# EAGLE design DummyLoad (EAGLE 5.10)
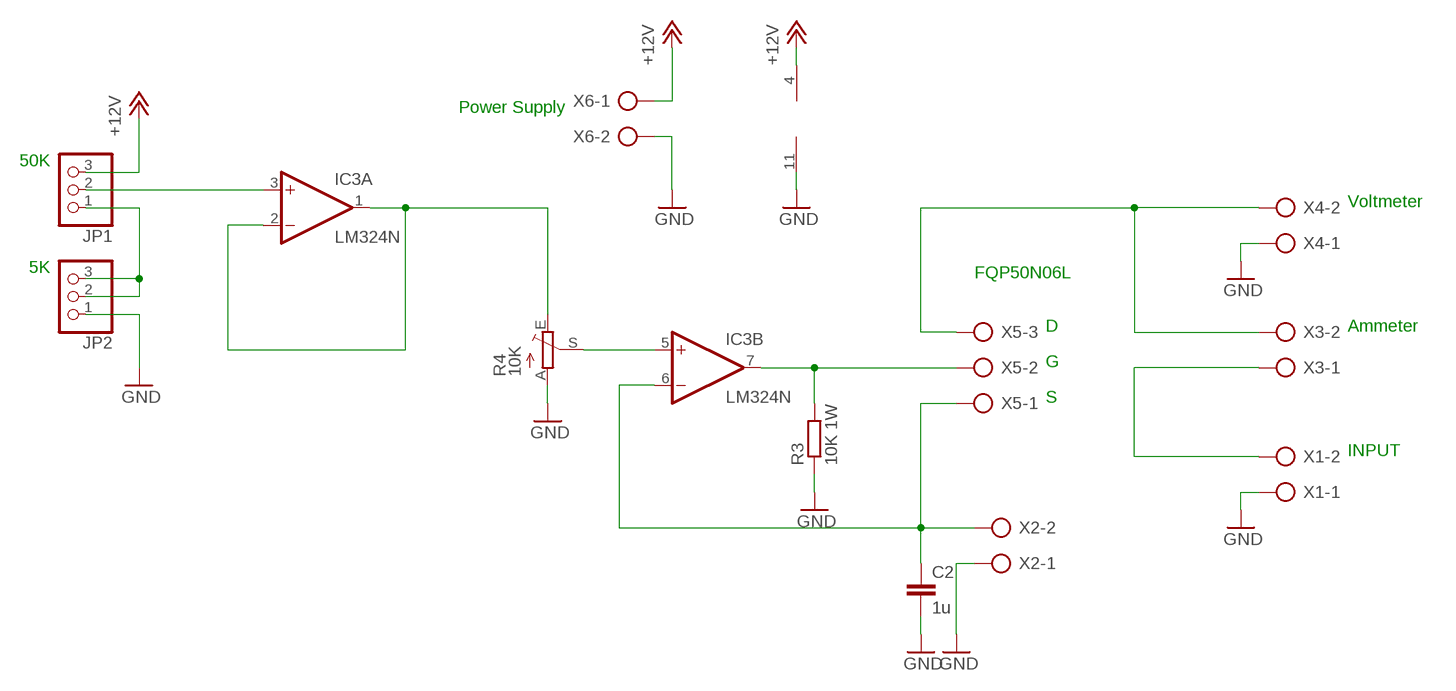
[diagram p0: schematic, sheet 1]

## Parts
C2  1u  C-EU102-043X133  [C102-043X133]
IC3  LM324N  [DIL14]
JP1  PINHD-1X3  [1X03]
JP2  PINHD-1X3  [1X03]
R3  10K 1W  R-EU_0309/12  [0309/12]
R4  10K  TRIM_EU-B64Y  [B64Y]
X1  AK300/2  [AK300/2]
X2  AK300/2  [AK300/2]
X3  AK300/2  [AK300/2]
X4  AK300/2  [AK300/2]
X5  AK300/3  [AK300/3]
X6  AK300/2  [AK300/2]

## Nets
+12V: IC3.4(P:V+) JP1.3 X6.1
GND: C2.2 IC3.11(P:V-) JP2.1 R3.1 R4.A X1.1 X2.1 X4.1 X6.2
N$1: IC3.1(A:OUT) IC3.2(A:-IN) R4.E
N$2: IC3.7(B:OUT) R3.2 X5.2
N$3: IC3.5(B:+IN) R4.S
N$4: X1.2 X3.1
N$5: IC3.3(A:+IN) JP1.2
N$7: C2.1 IC3.6(B:-IN) X2.2 X5.1
N$8: JP1.1 JP2.2 JP2.3
N$9: X3.2 X4.2 X5.3
Unconnected: IC3.8(C:OUT) IC3.9(C:-IN) IC3.10(C:+IN) IC3.12(D:+IN) IC3.13(D:-IN) IC3.14(D:OUT)

## Notes on the sheet
- Power Supply
- 50K
- Voltmeter
- 5K
- FQP50N06L
- D | Ammeter
- G
- S
- INPUT

## Library data of the parts
C2 = resistor:C-EU: CAPACITOR, European symbol
IC3 = linear:LM324: OP AMP
JP1 JP2 = pinhead:PINHD-1X3: PIN HEADER
R3 = resistor:R-EU_: RESISTOR, European symbol
R4 = pot:TRIM_EU-: POTENTIOMETER
X1-X4 X6 = con-ptr500:AK300/2: CONNECTOR
X5 = con-ptr500:AK300/3: CONNECTOR

## Net classes
0 default: width 0.508 mm, drill 0.762 mm, clearance 0.508 mm

## Board
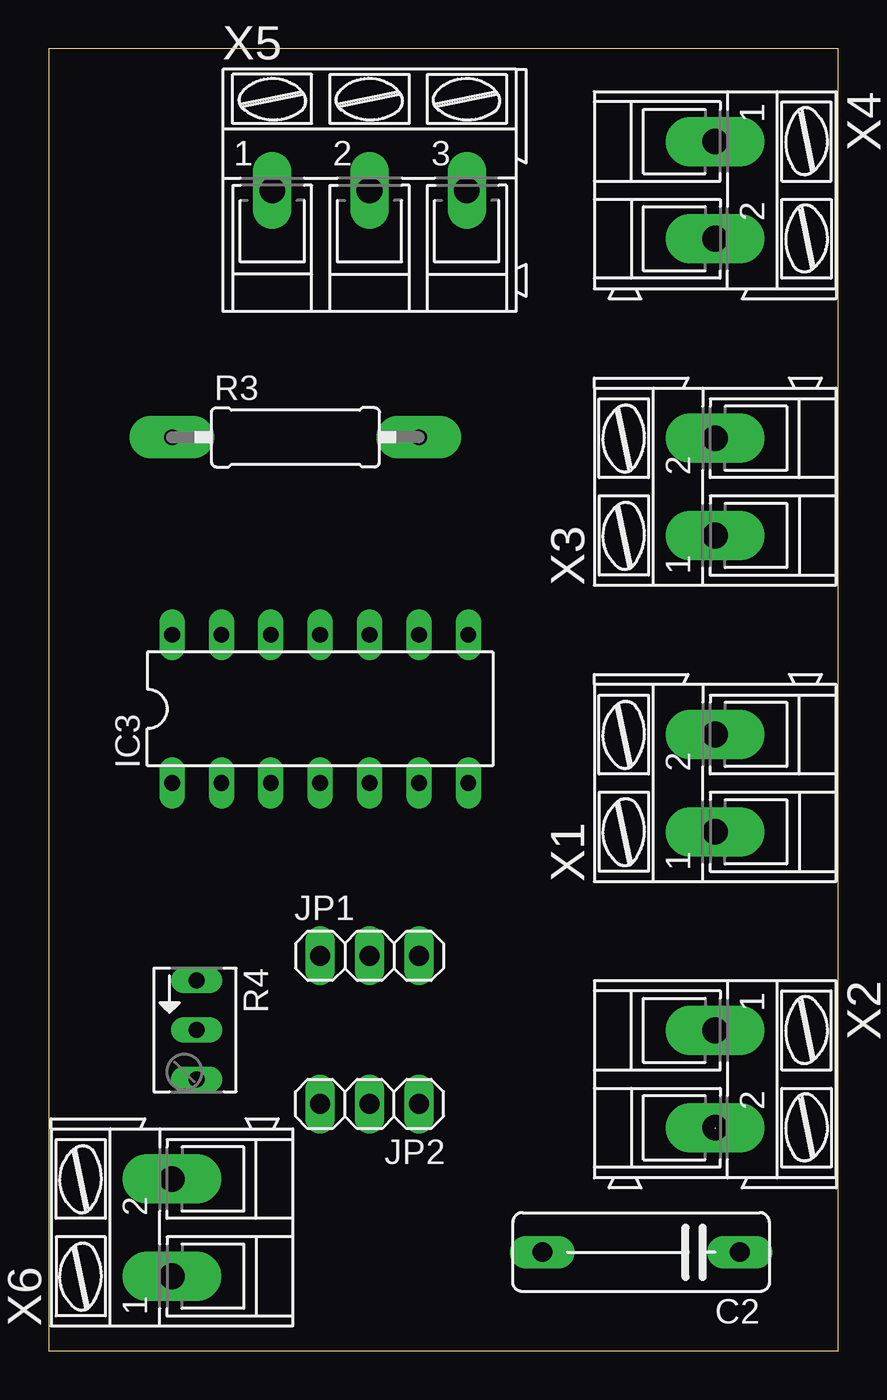
[diagram p1: board, top side]
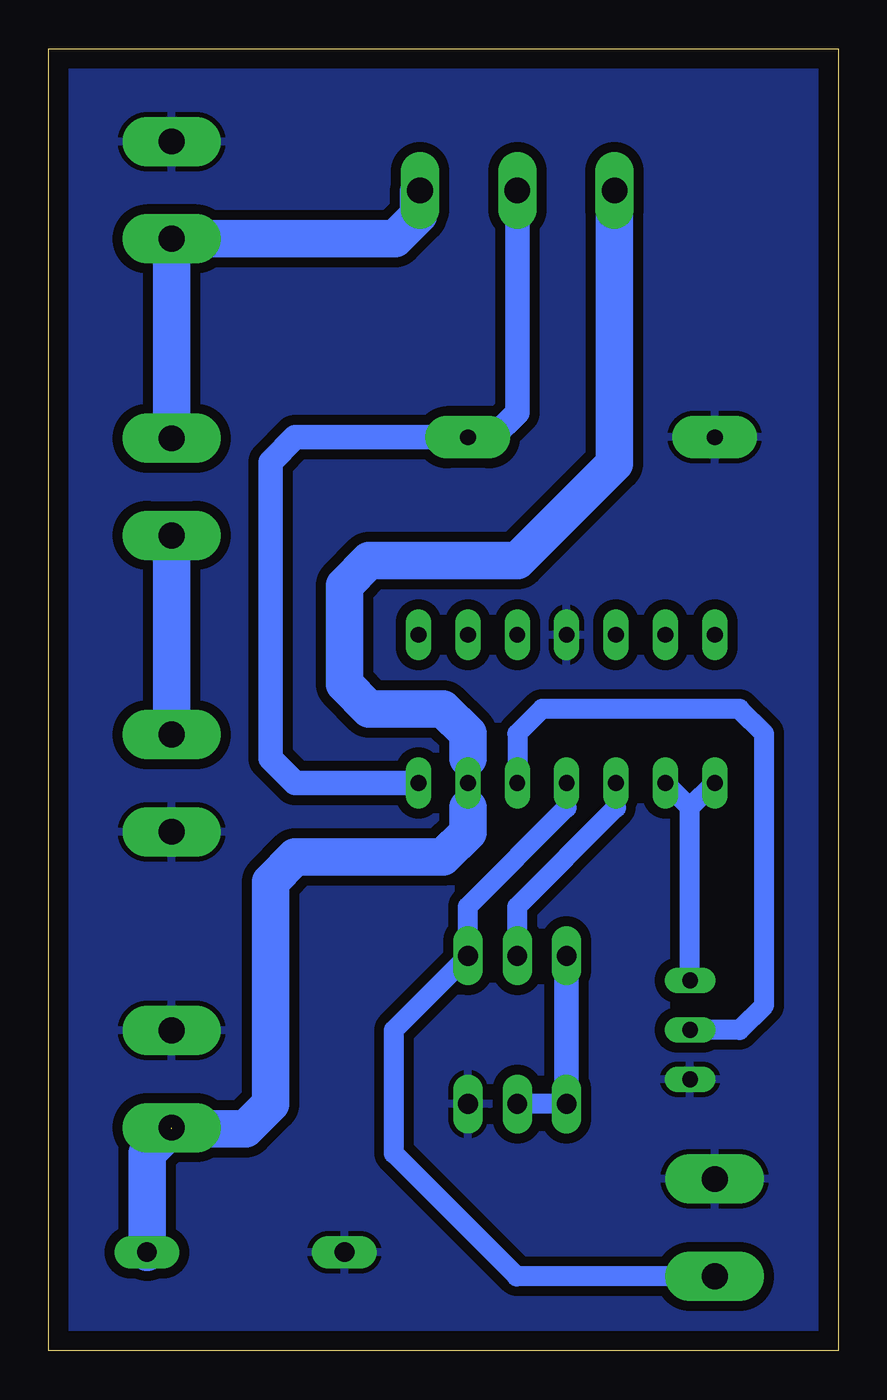
[diagram p2: board, bottom side, seen from below]

Size 40.62 x 66.98 mm. Coordinates in mm from the lower left corner, seen from the top.
Outline: 0,0 40.62,0 40.62,66.98 0,66.98 0,0
Copper layers (1*16): Top 0.035mm / dielectric 1.5mm / Bottom 0.035mm
Design rules "default": minimum track width 10mil, minimum drill 24mil, track to track 8mil, track to pad 8mil, pad to pad 8mil, via to via 8mil, smd to smd 8mil, copper to edge 40mil, drill to drill 8mil, minimum pad ring 10mil, minimum via ring 8mil, stop-mask expansion 4mil, vias tented up to drill 0mil, thermal gap 10mil

### Footprints (pad centres in the part's own frame; a part is rotated, then mirrored left to right if it is on the bottom)
C102-043X133 = drill 1.016 pad 1.676 long: 1 -5.08,0; 2 5.08,0
DIL14 = drill 0.813 long: 1 -7.62,-3.81; 2 -5.08,-3.81; 3 -2.54,-3.81; 4 0,-3.81; 5 2.54,-3.81; 6 5.08,-3.81; 7 7.62,-3.81; 8 7.62,3.81; 9 5.08,3.81; 10 2.54,3.81; 11 0,3.81; 12 -2.54,3.81; 13 -5.08,3.81; 14 -7.62,3.81
1X03 = drill 1.016 long: 1 -2.54,0; 2 0,0; 3 2.54,0
0309/12 = drill 0.813 pad 2.184 long: 1 -6.35,0; 2 6.35,0
B64Y = drill 0.813 long: A 2.54,0; E -2.54,0; S 0,0
AK300/2 = drill 1.321 pad 2.54 long: 1 -2.515,0; 2 2.489,0
AK300/3 = drill 1.321 long: 1 -5.004,0; 2 0,0; 3 5.004,0

### Placement (x,y rotation side)
C2  30.48,5.08 180 top
IC3  13.97,33.02 0 top
JP1  16.51,20.32 0 top
JP2  16.51,12.7 180 top
R3  12.7,46.99 0 top
R4  7.62,16.51 270 top
X1  34.29,29.21 90 top
X2  34.29,13.97 270 top
X3  34.29,44.45 90 top
X4  34.29,59.69 270 top
X5  16.51,59.69 0 top
X6  6.35,6.35 90 top

### Tracks (layer width: path | path; a pad name or v marks a point on that pad's centre or on a via)
+12V
  Bottom 1.016: IC3.4 13.97,27.94 19.05,22.86 JP1.3 22.86,16.51 22.86,10.16 16.54,3.83 X6.1
GND
  pour Bottom: -1.27,68.58 41.91,68.58 41.91,-1.27 -1.27,-1.27
N$1
  Bottom 1.016: R4.E 7.62,27.94 | 7.62,27.94 IC3.1 | 7.62,27.94 IC3.2
N$2
  Bottom 1.27: X5.2 16.51,48.26 17.78,46.99 R3.2 27.94,46.99 29.21,45.72 29.21,30.48 27.94,29.21 IC3.7
N$3
  Bottom 1.016: R4.S 5.08,16.51 3.81,17.78 3.81,31.75 5.08,33.02 15.24,33.02 16.51,31.75 IC3.5
N$4
  Bottom 1.93: X1.2 X3.1
N$5
  Bottom 1.016: IC3.3 11.43,27.94 16.51,22.86 JP1.2
N$7  (1 unrouted)
  Bottom 1.27: 19.05,27.94 IC3.6 19.05,30.48
  Bottom 1.93: C2.1 35.56,10.16 34.29,11.43 30.48,11.43 29.21,12.7 29.21,24.13 27.94,25.4 20.32,25.4 19.05,26.67 19.05,27.94 | X5.1 11.51,45.64 16.51,40.64 24.13,40.64 25.4,39.37 25.4,34.29 24.13,33.02 20.32,33.02 19.05,31.75 19.05,30.48
N$8
  Bottom 1.016: JP2.3 JP2.2
  Bottom 1.27: JP2.3 JP1.1
N$9
  Bottom 1.93: X3.2 X4.2 22.81,57.2 21.59,58.42 21.59,59.61 X5.3